# Altium project NE-CurrentSense-V3.PrjPcb
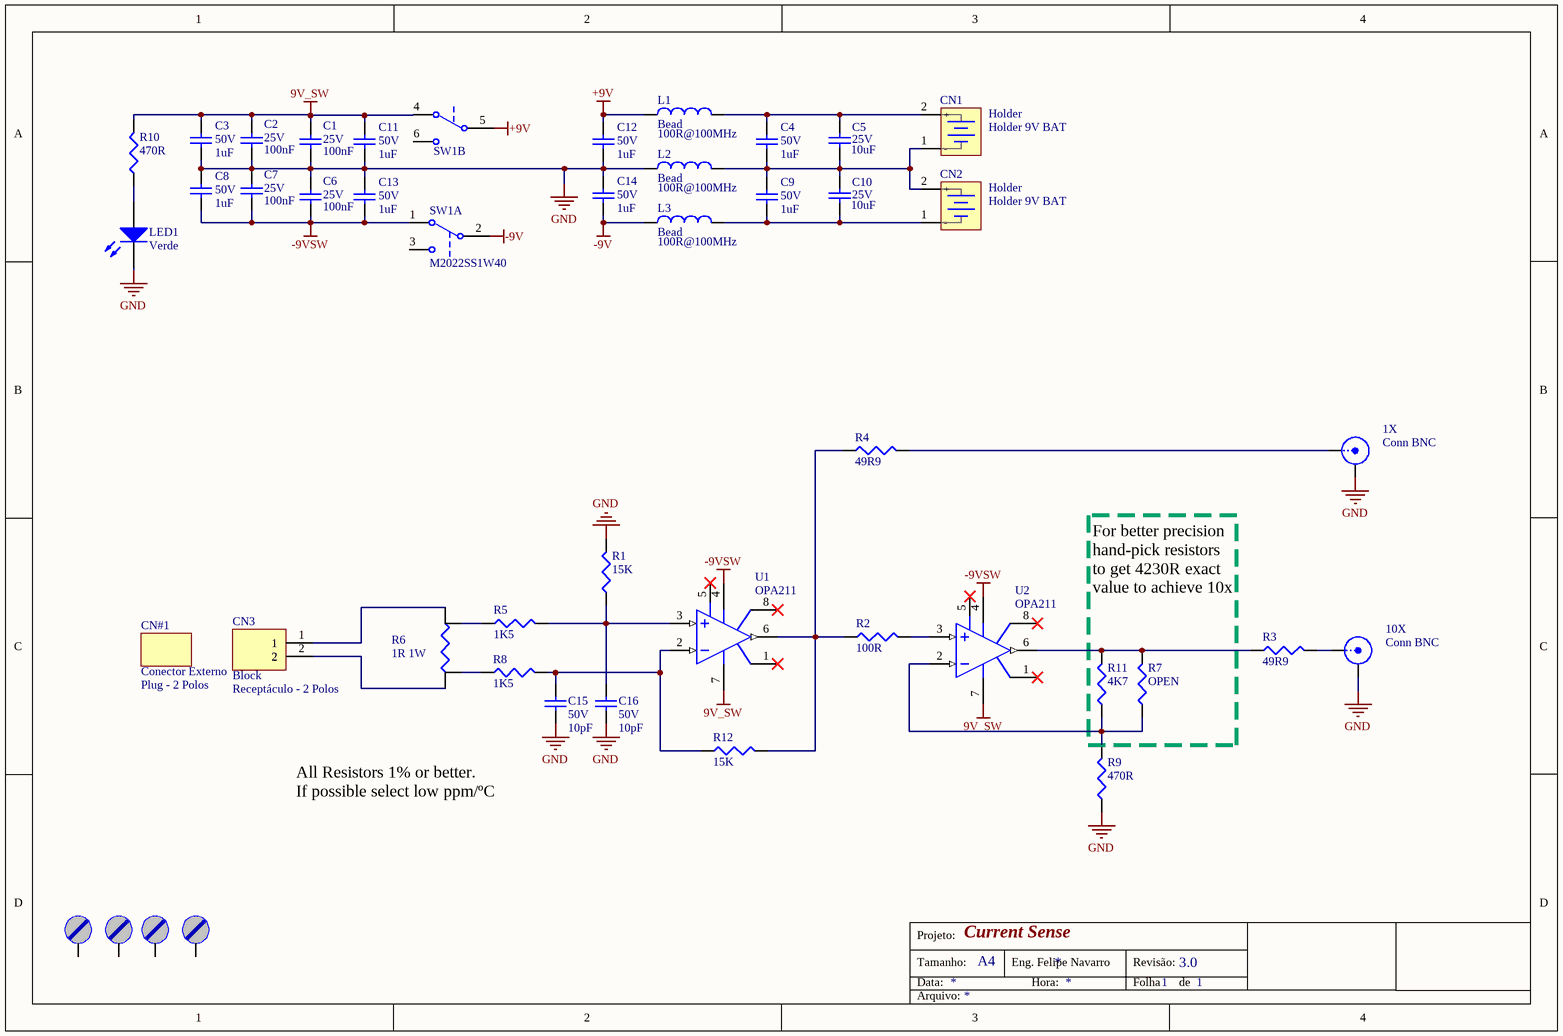
[diagram p0: NE-CurrentSense-V3.SchDoc]
1 sheet, 45 parts. Net scope: global (net labels, ports and power ports of the same name join across sheets).
Board file: NE-CurrentSense-V3.PcbDoc

## Sheet NE-CurrentSense-V3.SchDoc: Current Sense
size A4; Organization: Altium Limited; Address1: L3, 12a Rodborough Rd; Address2: Frenchs Forest; Address3: NSW; Address4: Australia 2086; Revision: 3.0; SheetNumber: 1; SheetTotal: 1

### Parts
1X  Conn BNC  [CONN BNC-JACK]
10X  Conn BNC  [CONN BNC-JACK]
C1  value 100nF  Tensão: 25V  [CC0603]  (hidden comment: Capacitor Cerâmico)
C2  value 100nF  Tensão: 25V  [CC0603]  (hidden comment: Capacitor Cerâmico)
C3  value 1uF  Tensão: 50V  [CC0603]  (hidden comment: Capacitor Cerâmico)
C4  value 1uF  Tensão: 50V  [CC0603]  (hidden comment: Capacitor Cerâmico)
C5  value 10uF  Tensão: 25V  [CC0805]  (hidden comment: Capacitor Cerâmico)
C6  value 100nF  Tensão: 25V  [CC0603]  (hidden comment: Capacitor Cerâmico)
C7  value 100nF  Tensão: 25V  [CC0603]  (hidden comment: Capacitor Cerâmico)
C8  value 1uF  Tensão: 50V  [CC0603]  (hidden comment: Capacitor Cerâmico)
C9  value 1uF  Tensão: 50V  [CC0603]  (hidden comment: Capacitor Cerâmico)
C10  value 10uF  Tensão: 25V  [CC0805]  (hidden comment: Capacitor Cerâmico)
C11  value 1uF  Tensão: 50V  [CC0603]  (hidden comment: Capacitor Cerâmico)
C12  value 1uF  Tensão: 50V  [CC0603]  (hidden comment: Capacitor Cerâmico)
C13  value 1uF  Tensão: 50V  [CC0603]  (hidden comment: Capacitor Cerâmico)
C14  value 1uF  Tensão: 50V  [CC0603]  (hidden comment: Capacitor Cerâmico)
C15  value 10pF  Tensão: 50V  [CC0603]  (hidden comment: Capacitor Cerâmico)
C16  value 10pF  Tensão: 50V  [CC0603]  (hidden comment: Capacitor Cerâmico)
CN1  Holder  value Holder 9V BAT  [BATTHOLDER-9V-BH9V-PC-ND]
CN2  Holder  value Holder 9V BAT  [BATTHOLDER-9V-BH9V-PC-ND]
CN3  Block  value Receptáculo - 2 Polos  [CONN BLOCK2 RCPT/H]
CN#1  Conector Externo  value Plug - 2 Polos  [N/A]
HOLE1  Furo de Fixação  [Furo_M3]  (value not drawn)  (no BOM)
HOLE3  Furo de Fixação  [Furo_M3]  (value not drawn)  (no BOM)
HOLE4  Furo de Fixação  [Furo_M3]  (value not drawn)  (no BOM)
HOLE5  Furo de Fixação  [Furo_M3]  (value not drawn)  (no BOM)
L1  Bead  value 100R@100MHz  [CC0603]
L2  Bead  value 100R@100MHz  [CC0603]
L3  Bead  value 100R@100MHz  [CC0603]
LED1  value Verde  [LED-INDIC]  (hidden comment: LED)
R1  value 15K  [CC0603]  (hidden comment: Resistor)
R2  value 100R  [CC0603]  (hidden comment: Resistor)
R3  value 49R9  [CC0603]  (hidden comment: Resistor)
R4  value 49R9  [CC0603]  (hidden comment: Resistor)
R5  value 1K5  [CC0603]  (hidden comment: Resistor)
R6  value 1R 1W  [CC2516 - Wide Vishay]  (hidden comment: Resistor)
R7  value OPEN  [CC0603]  (hidden comment: Resistor Open)  (no BOM)
R8  value 1K5  [CC0603]  (hidden comment: Resistor)
R9  value 470R  [CC0603]  (hidden comment: Resistor)
R10  value 470R  [CC0603]  (hidden comment: Resistor)
R11  value 4K7  [CC0603]  (hidden comment: Resistor)
R12  value 15K  [CC0603]  (hidden comment: Resistor)
SW1  M2022SS1W40  [SWITCH TOGGLE DPDT 6A 125V]  (parts A,B of 2)
U1  OPA211  [SOIC-8N]
U2  OPA211  [SOIC-8N]

### Nets
9V_SW: C1.2 C2.2 C3.2 C11.2 R10.2 SW1.4(NC2) U1.7(V+) U2.7(V+)
+9V: C12.2 L1.1 SW1.5(C2)
-9V: C14.1 L3.1 SW1.2(C1)
-9VSW: C6.1 C7.1 C8.1 C13.1 SW1.1(NC1) U1.4(V-) U2.4(V-)
GND: 1X.2(Y) 10X.2(Y) C1.1 C2.1 C3.1 C6.2 C7.2 C8.2 C11.1 C12.1 C13.2 C14.2 C15.1 C16.1 L2.1 LED1.2(K) R1.2 R9.1
Net1X_1: 1X.1(X) R4.2
Net10X_1: 10X.1(X) R3.2
NetC4_1: C4.1 C5.1 C9.2 C10.2 CN1.1(-) CN2.2(+) L2.2
NetC4_2: C4.2 C5.2 CN1.2(+) L1.2
NetC9_1: C9.1 C10.1 CN2.1(-) L3.2
NetC15_2: C15.2 R8.2 R12.1 U1.2(IN-)
NetC16_2: C16.2 R1.1 R5.2 U1.3(IN+)
NetCN3_1: CN3.1 R6.3
NetCN3_2: CN3.2 R6.1
NetLED1_1: LED1.1(A) R10.1
NetR2_1: R2.1 R4.1 R12.2 U1.6(OUT)
NetR2_2: R2.2 U2.3(IN+)
NetR3_1: R3.1 R7.2 R11.2 U2.6(OUT)
NetR5_1: R5.1 R6.4
NetR6_2: R6.2 R8.1
NetR7_1: R7.1 R9.2 R11.1 U2.2(IN-)

Not connected (* = marked no-connect by the designer): HOLE1 X; HOLE3 X; HOLE4 X; HOLE5 X; SW1 3(NO1) 6(NO2); U1 1(NC)* 5(NC)* 8(NC)*; U2 1(NC)* 5(NC)* 8(NC)*

### Notes on the sheet
- For better precision hand-pick resistors to get 4230R exact value to achieve 10x
- All Resistors 1% or better.
  If possible select low ppm/ºC
- Projeto:
- Tamanho:
- Data:
- A4
- Eng. Felipe Navarro
- Hora:
- Revisão:
- Folha
- de
- Arquivo:

### Library data of the parts
1X 10X = Conn BNC: Conector BNC; ChinesePrice: 0,00000; Chinês: ----; Value: Jack BNC; Corrente: *; Potência: *; Supplier 1: Digi-Key; Supplier Part Number 1: A97570-ND; Tensão: *; Obs:: *; Tolerância: *; ComponentLink1Description: Datasheet; ComponentLink1URL: D:\Tecnoclade\Datasheet\!DataMissing.pdf
C1 C2 C6 C7 = Cap 100nF 25V 0603 X7R: Capacitor (Semiconductor SIM Model); Chinês: Local; ChinesePrice: 0,00246; Corrente: *A; Potência: *W; Obs:: X7R; Tolerância: ±10%; Supplier 1: Digi-Key; Supplier Part Number 1: 490-1524-1-ND; ComponentLink1Description: Datasheet; ComponentLink1URL: D:\Tecnoclade\Datasheet\!DataMissing.pdf
C3 C4 C8 C9 C11-C14 = Cap 1uF 50V 0603 X5R: Capacitor (Semiconductor SIM Model); Chinês: Local; ChinesePrice: 0,01100; Corrente: *A; Potência: *W; Obs:: X5R; Tolerância: ±10%; Supplier 1: Digi-Key; Supplier Part Number 1: 587-2400-1-ND; ComponentLink1Description: Datasheet; ComponentLink1URL: D:\Tecnoclade\Datasheet\!DataMissing.pdf
C5 C10 = Cap 10uF 25V 0805 X5R: Capacitor (Semiconductor SIM Model); Chinês: Local; ChinesePrice: 0,02620; Corrente: *A; Potência: *W; Obs:: X5R; Tolerância: ±10%; Supplier 1: Digi-Key; Supplier Part Number 1: 587-2985-1-ND; ComponentLink1Description: Datasheet; ComponentLink1URL: D:\Tecnoclade\Datasheet\!DataMissing.pdf
C15 C16 = Cap 10pF 50V 0603 NP0 5%: Capacitor (Semiconductor SIM Model); Chinês: Local; ChinesePrice: 0,00180; Corrente: *A; Potência: *W; Obs:: NP0; Tolerância: ±5%; Supplier 1: Digi-Key; Supplier Part Number 1: 445-1269-1-ND; ComponentLink1Description: Datasheet; ComponentLink1URL: D:\Tecnoclade\Datasheet\!DataMissing.pdf
CN1 CN2 = BattHolder 9V: Corrente: *A; Chinês: ----; ChinesePrice: 0,00000; Tensão: *V; Potência: *; Supplier 1: Digi-Key; Supplier Part Number 1: BH9V-PC-ND; Obs:: *; Tolerância: *; ComponentLink1Description: Datasheet; ComponentLink1URL: D:\Tecnoclade\Datasheet\!DataMissing.pdf
CN3 = SHRD Block 2P RCPT-H P3.81mm: Conector Shrouded Block; ChinesePrice: 0,00000; Chinês: ----; Corrente: 10A; Tensão: 300V; Potência: *; Supplier 1: Digi-Key; Supplier Part Number 1: ED2808-ND; Obs:: *; Tolerância: *; ComponentLink1Description: Datasheet; ComponentLink1URL: D:\Tecnoclade\Datasheet\!DataMissing.pdf
CN#1 = Plug Block 2P 3.81mm: Conector Plug; Corrente: 10A; Tensão: 300V; Chinês: ----; ChinesePrice: 0,00000; Tolerância: 16~26 AWG; Supplier 1: Digi-Key; Supplier Part Number 1: ED2875-ND; Potência: *; Obs:: *; ComponentLink1Description: Datasheet; ComponentLink1URL: D:\Tecnoclade\Datasheet\!DataMissing.pdf
HOLE1 HOLE3-HOLE5 = Parafuso: Furo para parafuso; Value: M3; ChinesePrice: 0,00000; Chinês: ----; Corrente: *; Potência: *; Supplier 1: Digi-Key; Supplier Part Number 1: --Del; Tensão: *; Obs:: *; Tolerância: *; ComponentLink1Description: Datasheet; ComponentLink1URL: D:\Tecnoclade\Datasheet\!DataMissing.pdf
L1-L3 = Bd 100R@100MHz 0603 2A: ChinesePrice: 0,00000; Chinês: ----; Obs:: Ferrite (0R04); Tolerância: ±25%; Corrente: 2A; Potência: *; Supplier 1: Digi-Key; Supplier Part Number 1: 445-2984-1-ND; Tensão: *; ComponentLink1Description: Datasheet; ComponentLink1URL: D:\Tecnoclade\Datasheet\!DataMissing.pdf; Substituição: 00/00/0000
LED1 = LED2: Typical RED, GREEN, YELLOW, AMBER GaAs LED; ChinesePrice: 0,00000; Chinês: ----; VertSimCode: } XXXXX {; Supplier 1: Digi-Key; Supplier Part Number 1: 754-1297-ND
R1 R12 = Res 15K 0.1% 0603 1/10W: ChinesePrice: 0,00000; Chinês: -----; Corrente: *A; Potência: 1/10W; Tensão: *V; Obs: ±25ppm/ºC; Tolerância: ±0.1%; Supplier 1: Digi-Key; Supplier Part Number 1: P15KDBCT-ND; ComponentLink1Description: Datasheet; ComponentLink1URL: D:\Tecnoclade\Datasheet\!DataMissing.pdf
R2 = Res 100R 5% 0603 1/10W: ChinesePrice: 0,00080; Chinês: Local; Corrente: *A; Potência: 1/10W; Tensão: *V; Tolerância: ±5%; Supplier 1: Digi-Key; Supplier Part Number 1: RMCF0603JT100RCT-ND; Obs: *; ComponentLink1Description: Datasheet; ComponentLink1URL: D:\Tecnoclade\Datasheet\!DataMissing.pdf
R3 R4 = Res 49R9 1% 0603 1/10W: ChinesePrice: 0,00089; Chinês: Local; Corrente: *A; Potência: 1/10W; Tensão: *V; Tolerância: ±1%; Supplier 1: Digi-Key; Supplier Part Number 1: P49.9HCT-ND; Obs: *; ComponentLink1Description: Datasheet; ComponentLink1URL: D:\Tecnoclade\Datasheet\!DataMissing.pdf
R5 R8 = Res 1K5 1% 0603 1/10W: ChinesePrice: 0,00000; Chinês: ----; Corrente: *A; Potência: 1/10W; Tensão: *V; Obs: ±100ppm/ºC; Tolerância: ±1%; Supplier 1: Digi-Key; Supplier Part Number 1: 311-1.50KHRCT-ND; ComponentLink1Description: Datasheet; ComponentLink1URL: D:\Tecnoclade\Datasheet\!DataMissing.pdf
R6 = Res 1R 0.1% CC2516-Wide-4W 1W: ChinesePrice: 0,00000; Chinês: ----; Corrente: *A; Potência: 1/10W; Tensão: *V; Tolerância: ±*%; Obs:: *; ComponentLink1Description: Datasheet; ComponentLink1URL: D:\Tecnoclade\Datasheet\!DataMissing.pdf; Supplier 1: Digi-Key; Supplier Part Number 1: Y1606-1.0B-ND
R7 = Res Open 0603: Resistor; ChinesePrice: 0,00000; Chinês: ----; Corrente: *A; Potência: *W; Tensão: *V; Tolerância: ±*%; Supplier 1: Digi-Key; Supplier Part Number 1: --Del; Obs:: *; ComponentLink1Description: Datasheet; ComponentLink1URL: D:\Tecnoclade\Datasheet\!DataMissing.pdf
R9 R10 = Res 470R 5% 0603 1/10W: ChinesePrice: 0,00000; Chinês: ----; Corrente: *A; Potência: 1/10W; Tensão: *V; Obs: ±200ppm/ºC; Tolerância: ±5%; Supplier 1: Digi-Key; Supplier Part Number 1: RMCF0603JT470RCT-ND; ComponentLink1Description: Datasheet; ComponentLink1URL: D:\Tecnoclade\Datasheet\!DataMissing.pdf
R11 = Res 4K7 1% 0603 1/10W: ChinesePrice: 0,00000; Chinês: ----; Corrente: *A; Potência: 1/10W; Tensão: *V; Obs: ±100ppm/ºC; Tolerância: ±1%; Supplier 1: Digi-Key; Supplier Part Number 1: RMCF0603FT4K70CT-ND; ComponentLink1Description: Datasheet; ComponentLink1URL: D:\Tecnoclade\Datasheet\!DataMissing.pdf
SW1 = SW-DPDT: Double-Pole, Double-Throw Switch; ChinesePrice: 1,64000; Chinês: Local; Corrente: 6A; Tensão: 125V; Value: ON-ON; Potência: *; Supplier 1: Digi-Key; Supplier Part Number 1: M2022SS1W40-ND; Obs:: *; Tolerância: *; ComponentLink1Description: Datasheet; ComponentLink1URL: D:\Tecnoclade\Datasheet\
U1 U2 = OPA211: Operational Amplifier; Chinês: ----; ChinesePrice: 0,00000; Tensão: *; Value: *; Corrente: *; Potência: *; Supplier 1: Digi-Key; Supplier Part Number 1: 296-23403-1-ND; Obs:: *; Tolerância: *; ComponentLink1Description: Datasheet; ComponentLink1URL: D:\Tecnoclade\Datasheet\